# EAGLE design RemoteControl-v3 (EAGLE 7.3.0)
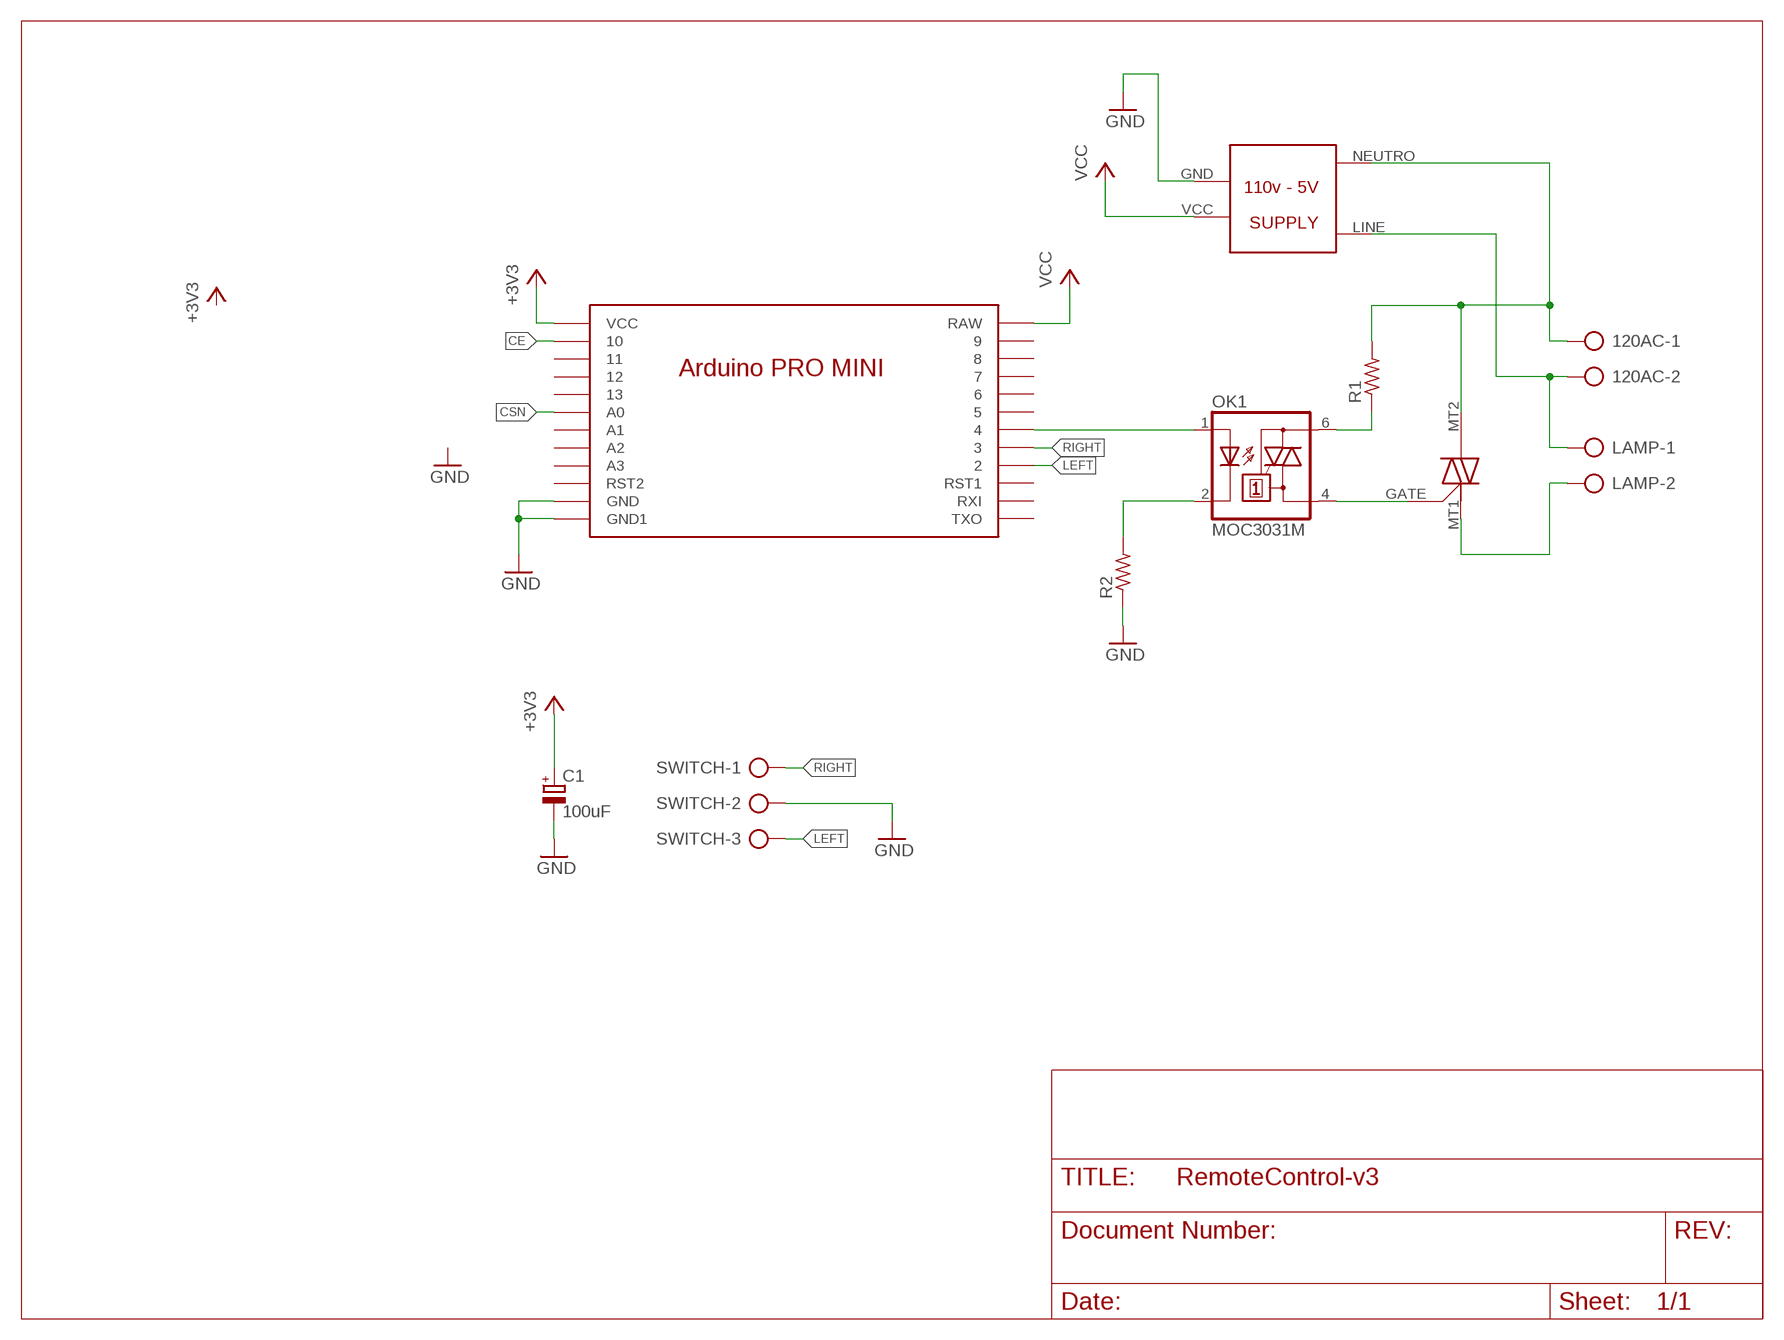
[diagram p0: schematic, sheet 1]

## Parts
120AC  AK300/2  [AK300/2]
C1  100uF  CPOL-EUE2.5-5  [E2,5-5]
LAMP  AK300/2  [AK300/2]
OK1  MOC3031M  [DIL06]
R1  R-US_0204/7  [0204/7]
R2  R-US_0204/7  [0204/7]
SWITCH  AK300/3  [AK300/3]
U$1  NANO  [NANO]
U$2  MAC12  [MAC12]
U$3  SUPPLY5V  [SUPPLY5V]

## Nets
+3V3: C1.+ U$1.VCC
CE: U$1.10
CSN: U$1.A0
GND: C1.- R2.1 SWITCH.2 U$1.GND1(GND) U$1.GND2(GND1) U$3.GND
LEFT: SWITCH.3 U$1.2
N$4: OK1.6(A2) R1.1
N$5: LAMP.2 U$2.MT1
N$6: 120AC.2 LAMP.1 U$3.LINE
N$7: 120AC.1 R1.2 U$2.MT2 U$3.NEUTRO
N$8: OK1.2(C) R2.2
N$10: OK1.4(A1) U$2.GATE
N$11: OK1.1(A) U$1.4
RIGHT: SWITCH.1 U$1.3
VCC: U$1.RAW U$3.VCC
Unconnected: U$1.5 U$1.6 U$1.7 U$1.8 U$1.9 U$1.11 U$1.12 U$1.13 U$1.A1 U$1.A2 U$1.A3 U$1.RST1 U$1.RST2 U$1.RXI U$1.TXO

## Library data of the parts
120AC LAMP = con-ptr500:AK300/2: CONNECTOR; OC_FARNELL: unknown; OC_NEWARK: unknown
C1 = resistor:CPOL-EU: POLARIZED CAPACITOR, European symbol
OK1 = optocoupler:MOC30*: 6-Pin DIP Zero-Cross Optoisolators Triac Driver Output (250/400 Volt Peak) Source: http://www.fairchildsemi.com/ds/MO/MOC3043-M.pdf; MF: FAIRCHILD SEMICONDUCTOR; MPN: MOC3031M; OC_FARNELL: 9875964; OC_NEWARK: 78K6089
R1 R2 = resistor:R-US_: RESISTOR, American symbol
SWITCH = con-ptr500:AK300/3: CONNECTOR; OC_FARNELL: unknown; OC_NEWARK: unknown
U$1 = E-Lab:NANO
U$2 = E-Lab:MAC12
U$3 = E-Lab:SUPPLY5V

## Board
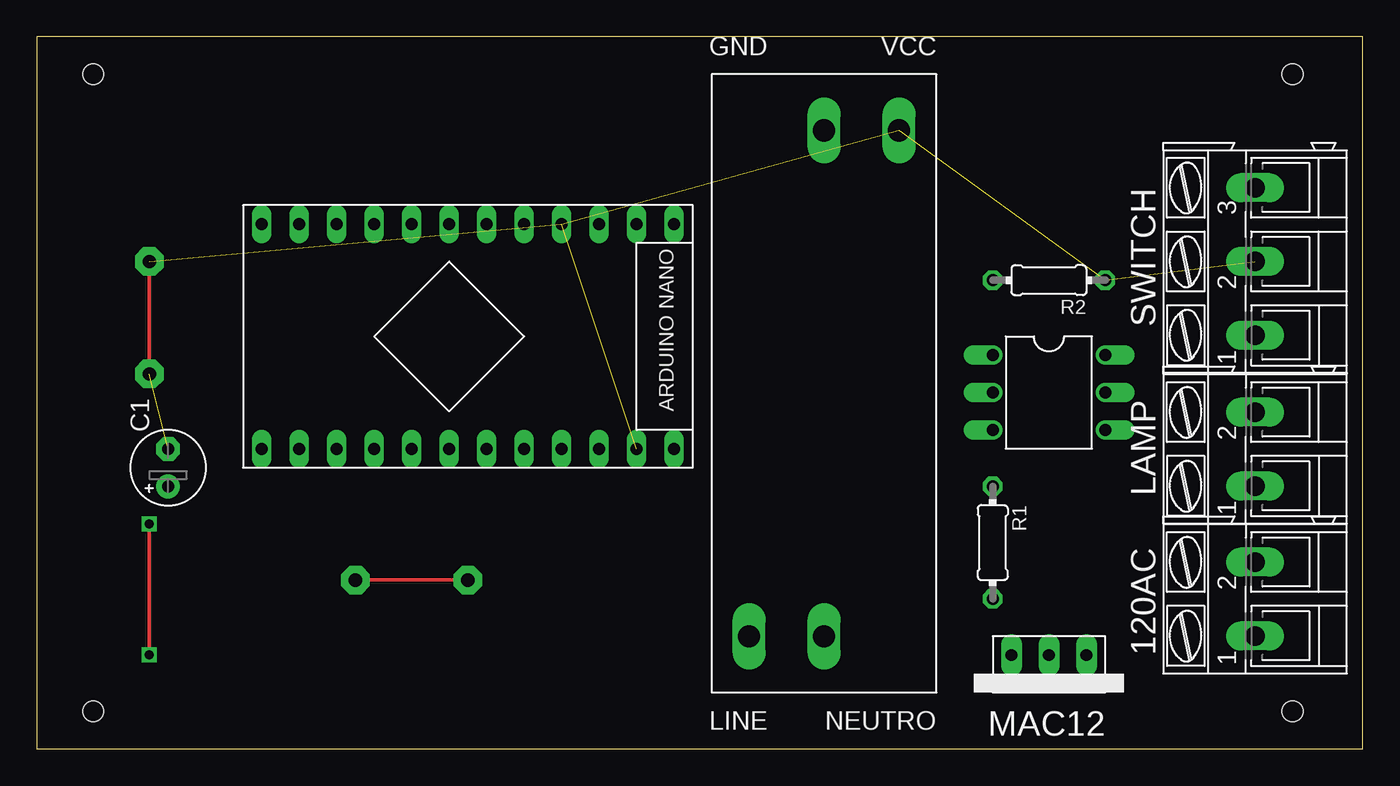
[diagram p1: board, top side]
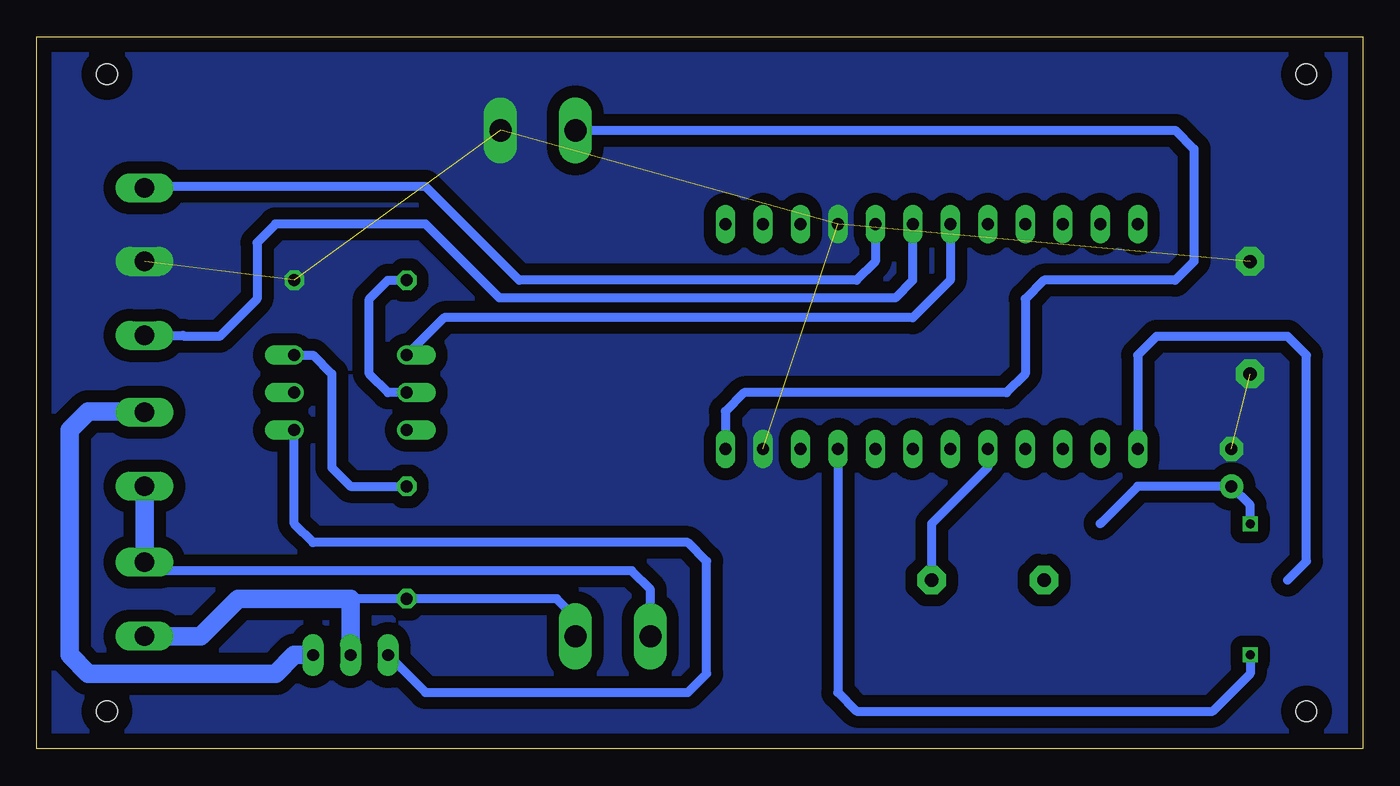
[diagram p2: board, bottom side, seen from below]

Size 89.84 x 48.25 mm. Coordinates in mm from the lower left corner, seen from the top.
Outline: 0,0 89.84,0 89.84,48.25 0,48.25 0,0
Copper layers (1*16): Top 0.035mm / dielectric 1.5mm / Bottom 0.035mm
Design rules "default": minimum track width 10mil, minimum drill 24mil, track to track 8mil, track to pad 8mil, pad to pad 8mil, via to via 8mil, smd to smd 8mil, copper to edge 40mil, drill to drill 8mil, minimum pad ring 10mil, minimum via ring 8mil, stop-mask expansion 4mil, vias tented up to drill 0mil, thermal gap 10mil
Holes 1.4 mm at 3.81,2.54 3.81,45.72 85.09,45.72 85.09,2.54

### Footprints (pad centres in the part's own frame; a part is rotated, then mirrored left to right if it is on the bottom)
AK300/2 = drill 1.321 long: 1 -2.515,0; 2 2.489,0
E2,5-5 = drill 0.813 pad 1.6: + -1.27,0 | drill 0.813 pad 1.6 octagon: - 1.27,0
DIL06 = drill 0.813 offset: 1 -2.54,-3.81; 2 0,-3.81; 3 2.54,-3.81; 4 2.54,3.81; 5 0,3.81; 6 -2.54,3.81
0204/7 = drill 0.813 octagon: 1 -3.81,0; 2 3.81,0
AK300/3 = drill 1.321 long: 1 -5.004,0; 2 0,0; 3 5.004,0
NANO = drill 0.8 long: 2 7.62,-5.08; 3 7.62,-2.54; 4 7.62,0; 5 7.62,2.54; 6 7.62,5.08; 7 7.62,7.62; 8 7.62,10.16; 9 7.62,12.7; 10 -7.62,12.7; 11 -7.62,10.16; 12 -7.62,7.62; 13 -7.62,5.08; A0 -7.62,2.54; A1 -7.62,0; A2 -7.62,-2.54; A3 -7.62,-5.08; GND1 -7.62,-12.7; GND2 7.62,-7.62; RAW -7.62,-15.24; RST1 -7.62,-10.16; RST2 7.62,-10.16; RXI 7.62,-12.7; TXO 7.62,-15.24; VCC -7.62,-7.62
MAC12 = drill 0.8 pad 1.422 long: GATE 2.54,0; MT1 -2.54,0; MT2 0,0
SUPPLY5V = drill 1.5 long: GND 17.78,-5.08; LINE -16.51,5.08; NEUTRO -16.51,0; VCC 17.78,0

### Placement (x,y rotation side)
120AC  82.55,10.16 90 top
C1  8.89,19.05 90 top
LAMP  82.55,20.32 90 top
OK1  68.58,24.13 270 top
R1  64.77,13.97 270 top
R2  68.58,31.75 180 top
SWITCH  82.55,33.02 90 top
U$1  27.94,27.94 90 top
U$2  68.58,6.35 180 top
U$3  53.34,24.13 90 top

### Tracks (layer width: path | path; a pad name or v marks a point on that pad's centre or on a via)
+3V3  (via drill 0.6)
  Top 0.254: v7.62,6.35 v7.62,15.24
  Bottom 0.61: U$1.VCC 35.56,3.81 34.29,2.54 10.16,2.54 7.62,5.08 v7.62,6.35 | v7.62,15.24 7.62,16.51 C1.+ 15.24,17.78 17.78,15.24
CE
  Bottom 0.61: 5.08,11.43 3.81,12.7 3.81,26.67 5.08,27.94 13.97,27.94 15.24,26.67 U$1.10
CSN  (via drill 0.9 pad 1.93)
  Top 0.254: v29.21,11.43 v21.59,11.43
  Bottom 0.61: U$1.A0 25.4,19.05 29.21,15.24 v29.21,11.43
GND  (via drill 0.9 pad 1.93)  (6 unrouted)
  Top 0.254: v7.62,25.4 v7.62,33.02
  pour Bottom (isolate 0.813, no thermals): 0,0 0,48.26 90.17,48.26 90.17,0
LEFT
  Bottom 0.61: U$1.2 33.02,33.02 34.29,31.75 57.15,31.75 63.5,38.1 82.47,38.1 SWITCH.3
N$4
  Bottom 0.61: OK1.6 71.12,26.67 69.85,25.4 69.85,19.05 68.58,17.78 R1.1
N$5
  Bottom 0.61: 82.6,22.86 LAMP.2
  Bottom 1.27: U$2.MT1 72.39,6.35 73.66,5.08 86.36,5.08 87.63,6.35 87.63,21.59 86.36,22.86 82.6,22.86
N$6
  Bottom 0.61: U$3.LINE 48.26,10.79 49.53,12.06 81.97,12.06 120AC.2
  Bottom 1.27: 120AC.2 LAMP.1
N$7
  Bottom 0.61: 83.8,7.62 120AC.1 | 82.58,7.62 120AC.1 | U$3.NEUTRO 53.34,8.89 54.61,10.16 R1.2 68.58,10.16 | 82.53,7.62 120AC.1
  Bottom 1.27: 82.53,7.62 78.74,7.62 76.2,10.16 68.58,10.16 U$2.MT2
N$8
  Bottom 0.61: OK1.2 66.04,24.13 67.31,25.4 67.31,30.48 66.04,31.75 R2.2
N$10
  Bottom 0.61: U$2.GATE 63.5,3.81 45.72,3.81 44.45,5.08 44.45,12.7 45.72,13.97 71.12,13.97 72.39,15.24 OK1.4
N$11
  Bottom 0.61: U$1.4 27.94,31.75 30.48,29.21 62.23,29.21 OK1.1
RIGHT
  Bottom 0.61: U$1.3 30.48,31.75 31.67,30.56 58.5,30.56 63.5,35.56 73.66,35.56 74.93,34.29 74.93,30.48 77.47,27.94 79.86,27.94 79.93,28.02 SWITCH.1
VCC
  Bottom 0.61: U$1.RAW 43.18,22.86 41.91,24.13 24.13,24.13 22.86,25.4 22.86,30.48 21.59,31.75 12.7,31.75 11.43,33.02 11.43,40.64 12.7,41.91 U$3.VCC